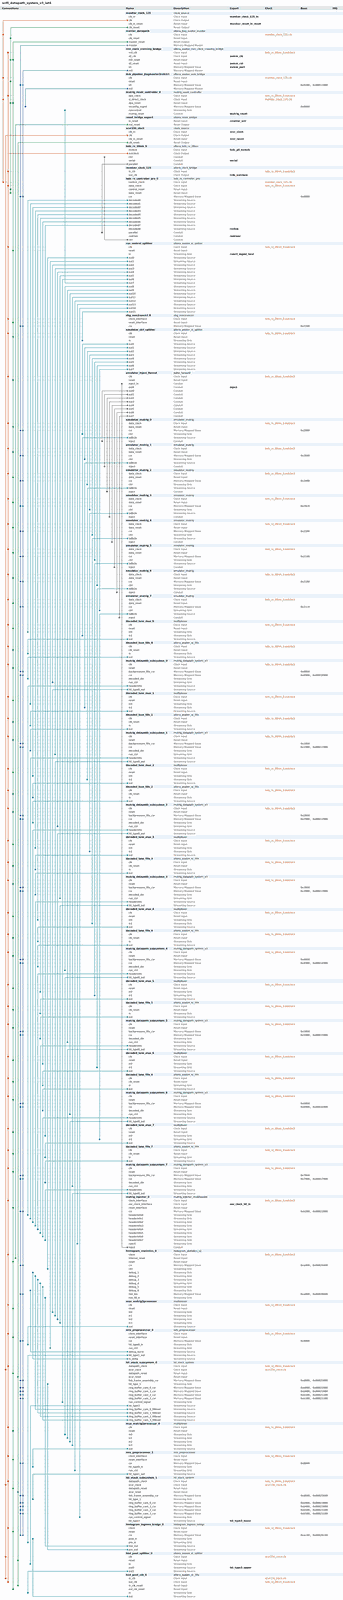
[diagram p0: system contents, whole]
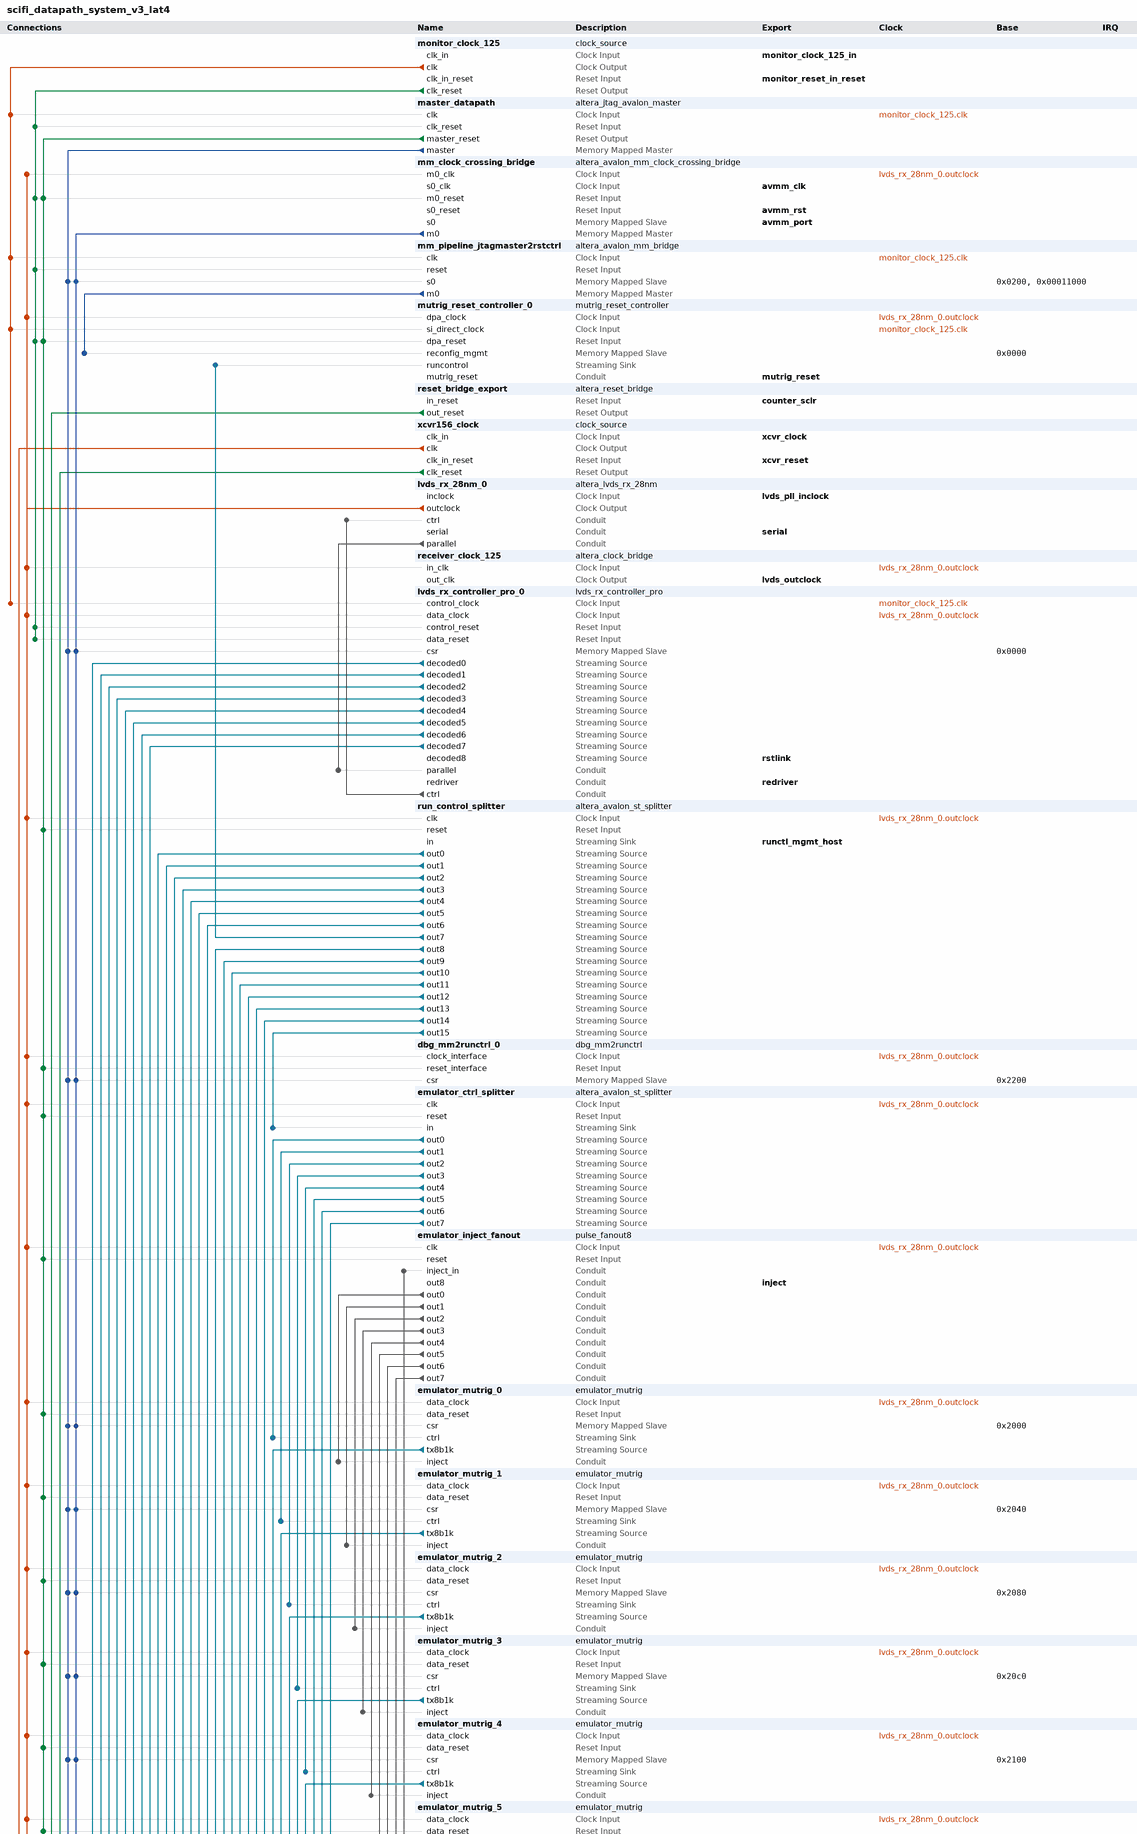
[diagram p1: system contents, upper part]
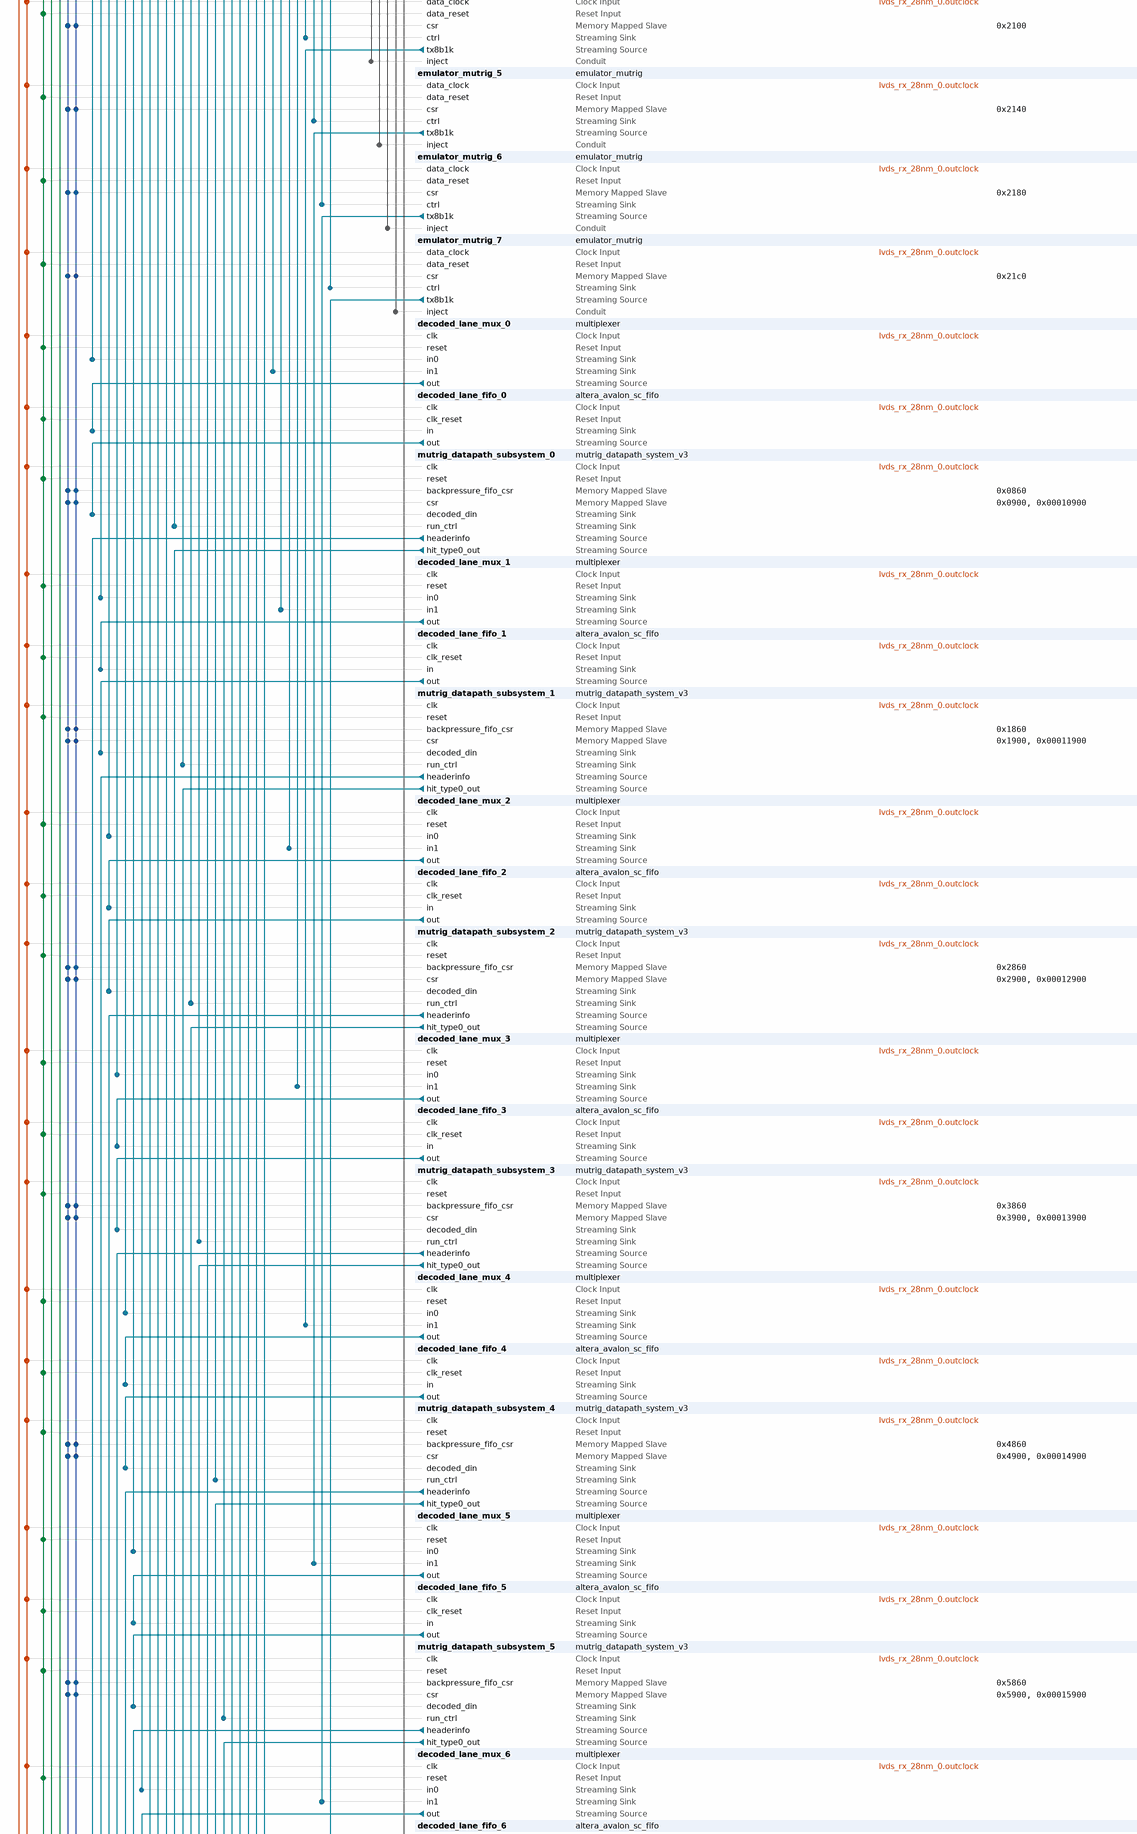
[diagram p2: system contents, middle part]
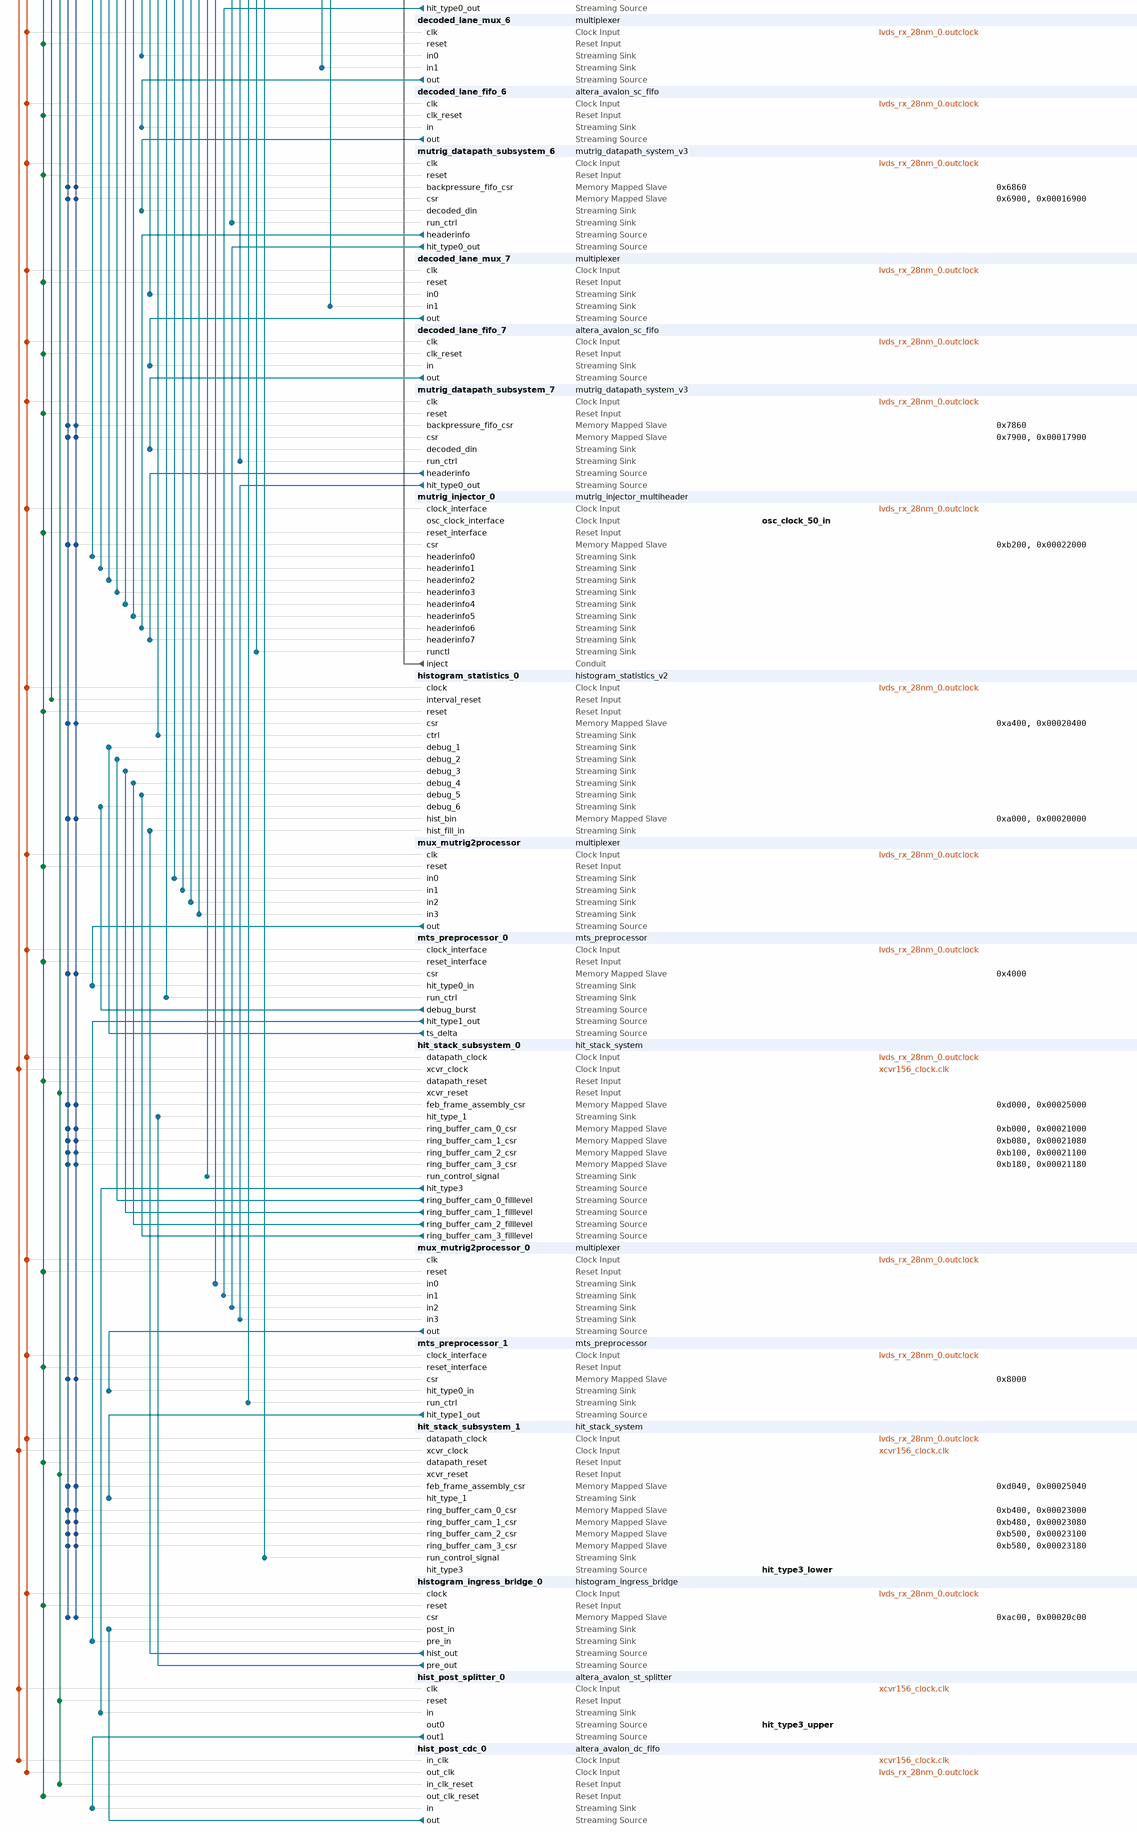
[diagram p3: system contents, lower part]
# Platform Designer (Qsys) system scifi_datapath_system_v3_lat4, Arria V 5AGXBA7D4F31C5
# Parameters at their usual value, and those the tool derives, are not listed.
package require -exact qsys 18.1
create_system scifi_datapath_system_v3_lat4
set_project_property DEVICE_FAMILY {Arria V}
set_project_property DEVICE 5AGXBA7D4F31C5

add_instance monitor_clock_125 clock_source 18.1
set_instance_parameter_value monitor_clock_125 clockFrequency 125000000
set_instance_parameter_value monitor_clock_125 resetSynchronousEdges DEASSERT

add_instance master_datapath altera_jtag_avalon_master 18.1

add_instance mm_clock_crossing_bridge altera_avalon_mm_clock_crossing_bridge 18.1
set_instance_parameter_value mm_clock_crossing_bridge ADDRESS_UNITS WORDS
set_instance_parameter_value mm_clock_crossing_bridge ADDRESS_WIDTH 14
set_instance_parameter_value mm_clock_crossing_bridge COMMAND_FIFO_DEPTH 8
set_instance_parameter_value mm_clock_crossing_bridge DATA_WIDTH 32
set_instance_parameter_value mm_clock_crossing_bridge MASTER_SYNC_DEPTH 2
set_instance_parameter_value mm_clock_crossing_bridge MAX_BURST_SIZE 256
set_instance_parameter_value mm_clock_crossing_bridge RESPONSE_FIFO_DEPTH 512
set_instance_parameter_value mm_clock_crossing_bridge SLAVE_SYNC_DEPTH 2
set_instance_parameter_value mm_clock_crossing_bridge USE_AUTO_ADDRESS_WIDTH 0

add_instance mm_pipeline_jtagmaster2rstctrl altera_avalon_mm_bridge 18.1
set_instance_parameter_value mm_pipeline_jtagmaster2rstctrl ADDRESS_UNITS WORDS
set_instance_parameter_value mm_pipeline_jtagmaster2rstctrl ADDRESS_WIDTH 6
set_instance_parameter_value mm_pipeline_jtagmaster2rstctrl DATA_WIDTH 32
set_instance_parameter_value mm_pipeline_jtagmaster2rstctrl MAX_PENDING_RESPONSES 4
set_instance_parameter_value mm_pipeline_jtagmaster2rstctrl PIPELINE_COMMAND 0
set_instance_parameter_value mm_pipeline_jtagmaster2rstctrl PIPELINE_RESPONSE 0
set_instance_parameter_value mm_pipeline_jtagmaster2rstctrl USE_AUTO_ADDRESS_WIDTH 0

add_instance mutrig_reset_controller_0 mutrig_reset_controller 1.0.8
set_instance_parameter_value mutrig_reset_controller_0 DEBUG 1
set_instance_parameter_value mutrig_reset_controller_0 RESET_LANE 2

add_instance reset_bridge_export altera_reset_bridge 18.1
set_instance_parameter_value reset_bridge_export ACTIVE_LOW_RESET 0
set_instance_parameter_value reset_bridge_export SYNCHRONOUS_EDGES none

add_instance xcvr156_clock clock_source 18.1
set_instance_parameter_value xcvr156_clock clockFrequency 156250000
set_instance_parameter_value xcvr156_clock resetSynchronousEdges BOTH

add_instance lvds_rx_28nm_0 altera_lvds_rx_28nm 24.0.1110
set_instance_parameter_value lvds_rx_28nm_0 N_LANE 9

add_instance receiver_clock_125 altera_clock_bridge 18.1
set_instance_parameter_value receiver_clock_125 DERIVED_CLOCK_RATE 125000000
set_instance_parameter_value receiver_clock_125 EXPLICIT_CLOCK_RATE 125000000

add_instance lvds_rx_controller_pro_0 lvds_rx_controller_pro 25.1.630
set_instance_parameter_value lvds_rx_controller_pro_0 AVMM_ADDR_W 4
set_instance_parameter_value lvds_rx_controller_pro_0 DECODED_USE_CHANNEL 1
set_instance_parameter_value lvds_rx_controller_pro_0 N_LANE 9
set_instance_parameter_value lvds_rx_controller_pro_0 SYNC_PATTERN_SEL 0xFA

add_instance run_control_splitter altera_avalon_st_splitter 18.1
set_instance_parameter_value run_control_splitter BITS_PER_SYMBOL 9
set_instance_parameter_value run_control_splitter CHANNEL_WIDTH 1
set_instance_parameter_value run_control_splitter DATA_WIDTH 9
set_instance_parameter_value run_control_splitter ERROR_WIDTH 1
set_instance_parameter_value run_control_splitter MAX_CHANNELS 1
set_instance_parameter_value run_control_splitter NUMBER_OF_OUTPUTS 16
set_instance_parameter_value run_control_splitter QUALIFY_VALID_OUT 0
set_instance_parameter_value run_control_splitter READY_LATENCY 0
set_instance_parameter_value run_control_splitter USE_CHANNEL 0
set_instance_parameter_value run_control_splitter USE_DATA 1
set_instance_parameter_value run_control_splitter USE_ERROR 0
set_instance_parameter_value run_control_splitter USE_PACKETS 0
set_instance_parameter_value run_control_splitter USE_READY 1
set_instance_parameter_value run_control_splitter USE_VALID 1

add_instance dbg_mm2runctrl_0 dbg_mm2runctrl 1.0.0

add_instance emulator_ctrl_splitter altera_avalon_st_splitter 18.1
set_instance_parameter_value emulator_ctrl_splitter BITS_PER_SYMBOL 9
set_instance_parameter_value emulator_ctrl_splitter CHANNEL_WIDTH 1
set_instance_parameter_value emulator_ctrl_splitter DATA_WIDTH 9
set_instance_parameter_value emulator_ctrl_splitter ERROR_WIDTH 1
set_instance_parameter_value emulator_ctrl_splitter MAX_CHANNELS 1
set_instance_parameter_value emulator_ctrl_splitter NUMBER_OF_OUTPUTS 8
set_instance_parameter_value emulator_ctrl_splitter QUALIFY_VALID_OUT 0
set_instance_parameter_value emulator_ctrl_splitter READY_LATENCY 0
set_instance_parameter_value emulator_ctrl_splitter USE_CHANNEL 0
set_instance_parameter_value emulator_ctrl_splitter USE_DATA 1
set_instance_parameter_value emulator_ctrl_splitter USE_ERROR 0
set_instance_parameter_value emulator_ctrl_splitter USE_PACKETS 0
set_instance_parameter_value emulator_ctrl_splitter USE_READY 1
set_instance_parameter_value emulator_ctrl_splitter USE_VALID 1

add_instance emulator_inject_fanout pulse_fanout8 26.2.0.0429

add_instance emulator_mutrig_0 emulator_mutrig 26.1.9.418
set_instance_parameter_value emulator_mutrig_0 ASIC_ID_DEFAULT 0
set_instance_parameter_value emulator_mutrig_0 BUILD 418
set_instance_parameter_value emulator_mutrig_0 CLUSTER_CENTER_GLOBAL_DEFAULT 16
set_instance_parameter_value emulator_mutrig_0 CLUSTER_CROSS_ASIC_DEFAULT 0
set_instance_parameter_value emulator_mutrig_0 CLUSTER_LANE_COUNT_DEFAULT 1
set_instance_parameter_value emulator_mutrig_0 CLUSTER_LANE_INDEX_DEFAULT 0
set_instance_parameter_value emulator_mutrig_0 CSR_ADDR_WIDTH 4
set_instance_parameter_value emulator_mutrig_0 DEBUG 0
set_instance_parameter_value emulator_mutrig_0 FIFO_DEPTH 64
set_instance_parameter_value emulator_mutrig_0 GIT_STAMP_OVERRIDE false
set_instance_parameter_value emulator_mutrig_0 INSTANCE_ID 0
set_instance_parameter_value emulator_mutrig_0 IP_UID 1162696020
set_instance_parameter_value emulator_mutrig_0 VERSION_DATE 20260418
set_instance_parameter_value emulator_mutrig_0 VERSION_GIT 30068584
set_instance_parameter_value emulator_mutrig_0 VERSION_MAJOR 26
set_instance_parameter_value emulator_mutrig_0 VERSION_MINOR 1
set_instance_parameter_value emulator_mutrig_0 VERSION_PATCH 9

add_instance emulator_mutrig_1 emulator_mutrig 26.1.9.418
set_instance_parameter_value emulator_mutrig_1 ASIC_ID_DEFAULT 0
set_instance_parameter_value emulator_mutrig_1 BUILD 418
set_instance_parameter_value emulator_mutrig_1 CLUSTER_CENTER_GLOBAL_DEFAULT 16
set_instance_parameter_value emulator_mutrig_1 CLUSTER_CROSS_ASIC_DEFAULT 0
set_instance_parameter_value emulator_mutrig_1 CLUSTER_LANE_COUNT_DEFAULT 1
set_instance_parameter_value emulator_mutrig_1 CLUSTER_LANE_INDEX_DEFAULT 0
set_instance_parameter_value emulator_mutrig_1 CSR_ADDR_WIDTH 4
set_instance_parameter_value emulator_mutrig_1 DEBUG 0
set_instance_parameter_value emulator_mutrig_1 FIFO_DEPTH 64
set_instance_parameter_value emulator_mutrig_1 GIT_STAMP_OVERRIDE false
set_instance_parameter_value emulator_mutrig_1 INSTANCE_ID 0
set_instance_parameter_value emulator_mutrig_1 IP_UID 1162696020
set_instance_parameter_value emulator_mutrig_1 VERSION_DATE 20260418
set_instance_parameter_value emulator_mutrig_1 VERSION_GIT 30068584
set_instance_parameter_value emulator_mutrig_1 VERSION_MAJOR 26
set_instance_parameter_value emulator_mutrig_1 VERSION_MINOR 1
set_instance_parameter_value emulator_mutrig_1 VERSION_PATCH 9

add_instance emulator_mutrig_2 emulator_mutrig 26.1.9.418
set_instance_parameter_value emulator_mutrig_2 ASIC_ID_DEFAULT 0
set_instance_parameter_value emulator_mutrig_2 BUILD 418
set_instance_parameter_value emulator_mutrig_2 CLUSTER_CENTER_GLOBAL_DEFAULT 16
set_instance_parameter_value emulator_mutrig_2 CLUSTER_CROSS_ASIC_DEFAULT 0
set_instance_parameter_value emulator_mutrig_2 CLUSTER_LANE_COUNT_DEFAULT 1
set_instance_parameter_value emulator_mutrig_2 CLUSTER_LANE_INDEX_DEFAULT 0
set_instance_parameter_value emulator_mutrig_2 CSR_ADDR_WIDTH 4
set_instance_parameter_value emulator_mutrig_2 DEBUG 0
set_instance_parameter_value emulator_mutrig_2 FIFO_DEPTH 64
set_instance_parameter_value emulator_mutrig_2 GIT_STAMP_OVERRIDE false
set_instance_parameter_value emulator_mutrig_2 INSTANCE_ID 0
set_instance_parameter_value emulator_mutrig_2 IP_UID 1162696020
set_instance_parameter_value emulator_mutrig_2 VERSION_DATE 20260418
set_instance_parameter_value emulator_mutrig_2 VERSION_GIT 30068584
set_instance_parameter_value emulator_mutrig_2 VERSION_MAJOR 26
set_instance_parameter_value emulator_mutrig_2 VERSION_MINOR 1
set_instance_parameter_value emulator_mutrig_2 VERSION_PATCH 9

add_instance emulator_mutrig_3 emulator_mutrig 26.1.9.418
set_instance_parameter_value emulator_mutrig_3 ASIC_ID_DEFAULT 0
set_instance_parameter_value emulator_mutrig_3 BUILD 418
set_instance_parameter_value emulator_mutrig_3 CLUSTER_CENTER_GLOBAL_DEFAULT 16
set_instance_parameter_value emulator_mutrig_3 CLUSTER_CROSS_ASIC_DEFAULT 0
set_instance_parameter_value emulator_mutrig_3 CLUSTER_LANE_COUNT_DEFAULT 1
set_instance_parameter_value emulator_mutrig_3 CLUSTER_LANE_INDEX_DEFAULT 0
set_instance_parameter_value emulator_mutrig_3 CSR_ADDR_WIDTH 4
set_instance_parameter_value emulator_mutrig_3 DEBUG 0
set_instance_parameter_value emulator_mutrig_3 FIFO_DEPTH 64
set_instance_parameter_value emulator_mutrig_3 GIT_STAMP_OVERRIDE false
set_instance_parameter_value emulator_mutrig_3 INSTANCE_ID 0
set_instance_parameter_value emulator_mutrig_3 IP_UID 1162696020
set_instance_parameter_value emulator_mutrig_3 VERSION_DATE 20260418
set_instance_parameter_value emulator_mutrig_3 VERSION_GIT 30068584
set_instance_parameter_value emulator_mutrig_3 VERSION_MAJOR 26
set_instance_parameter_value emulator_mutrig_3 VERSION_MINOR 1
set_instance_parameter_value emulator_mutrig_3 VERSION_PATCH 9

add_instance emulator_mutrig_4 emulator_mutrig 26.1.9.418
set_instance_parameter_value emulator_mutrig_4 ASIC_ID_DEFAULT 0
set_instance_parameter_value emulator_mutrig_4 BUILD 418
set_instance_parameter_value emulator_mutrig_4 CLUSTER_CENTER_GLOBAL_DEFAULT 16
set_instance_parameter_value emulator_mutrig_4 CLUSTER_CROSS_ASIC_DEFAULT 0
set_instance_parameter_value emulator_mutrig_4 CLUSTER_LANE_COUNT_DEFAULT 1
set_instance_parameter_value emulator_mutrig_4 CLUSTER_LANE_INDEX_DEFAULT 0
set_instance_parameter_value emulator_mutrig_4 CSR_ADDR_WIDTH 4
set_instance_parameter_value emulator_mutrig_4 DEBUG 0
set_instance_parameter_value emulator_mutrig_4 FIFO_DEPTH 64
set_instance_parameter_value emulator_mutrig_4 GIT_STAMP_OVERRIDE false
set_instance_parameter_value emulator_mutrig_4 INSTANCE_ID 0
set_instance_parameter_value emulator_mutrig_4 IP_UID 1162696020
set_instance_parameter_value emulator_mutrig_4 VERSION_DATE 20260418
set_instance_parameter_value emulator_mutrig_4 VERSION_GIT 30068584
set_instance_parameter_value emulator_mutrig_4 VERSION_MAJOR 26
set_instance_parameter_value emulator_mutrig_4 VERSION_MINOR 1
set_instance_parameter_value emulator_mutrig_4 VERSION_PATCH 9

add_instance emulator_mutrig_5 emulator_mutrig 26.1.9.418
set_instance_parameter_value emulator_mutrig_5 ASIC_ID_DEFAULT 0
set_instance_parameter_value emulator_mutrig_5 BUILD 418
set_instance_parameter_value emulator_mutrig_5 CLUSTER_CENTER_GLOBAL_DEFAULT 16
set_instance_parameter_value emulator_mutrig_5 CLUSTER_CROSS_ASIC_DEFAULT 0
set_instance_parameter_value emulator_mutrig_5 CLUSTER_LANE_COUNT_DEFAULT 1
set_instance_parameter_value emulator_mutrig_5 CLUSTER_LANE_INDEX_DEFAULT 0
set_instance_parameter_value emulator_mutrig_5 CSR_ADDR_WIDTH 4
set_instance_parameter_value emulator_mutrig_5 DEBUG 0
set_instance_parameter_value emulator_mutrig_5 FIFO_DEPTH 64
set_instance_parameter_value emulator_mutrig_5 GIT_STAMP_OVERRIDE false
set_instance_parameter_value emulator_mutrig_5 INSTANCE_ID 0
set_instance_parameter_value emulator_mutrig_5 IP_UID 1162696020
set_instance_parameter_value emulator_mutrig_5 VERSION_DATE 20260418
set_instance_parameter_value emulator_mutrig_5 VERSION_GIT 30068584
set_instance_parameter_value emulator_mutrig_5 VERSION_MAJOR 26
set_instance_parameter_value emulator_mutrig_5 VERSION_MINOR 1
set_instance_parameter_value emulator_mutrig_5 VERSION_PATCH 9

add_instance emulator_mutrig_6 emulator_mutrig 26.1.9.418
set_instance_parameter_value emulator_mutrig_6 ASIC_ID_DEFAULT 0
set_instance_parameter_value emulator_mutrig_6 BUILD 418
set_instance_parameter_value emulator_mutrig_6 CLUSTER_CENTER_GLOBAL_DEFAULT 16
set_instance_parameter_value emulator_mutrig_6 CLUSTER_CROSS_ASIC_DEFAULT 0
set_instance_parameter_value emulator_mutrig_6 CLUSTER_LANE_COUNT_DEFAULT 1
set_instance_parameter_value emulator_mutrig_6 CLUSTER_LANE_INDEX_DEFAULT 0
set_instance_parameter_value emulator_mutrig_6 CSR_ADDR_WIDTH 4
set_instance_parameter_value emulator_mutrig_6 DEBUG 0
set_instance_parameter_value emulator_mutrig_6 FIFO_DEPTH 64
set_instance_parameter_value emulator_mutrig_6 GIT_STAMP_OVERRIDE false
set_instance_parameter_value emulator_mutrig_6 INSTANCE_ID 0
set_instance_parameter_value emulator_mutrig_6 IP_UID 1162696020
set_instance_parameter_value emulator_mutrig_6 VERSION_DATE 20260418
set_instance_parameter_value emulator_mutrig_6 VERSION_GIT 30068584
set_instance_parameter_value emulator_mutrig_6 VERSION_MAJOR 26
set_instance_parameter_value emulator_mutrig_6 VERSION_MINOR 1
set_instance_parameter_value emulator_mutrig_6 VERSION_PATCH 9

add_instance emulator_mutrig_7 emulator_mutrig 26.1.9.418
set_instance_parameter_value emulator_mutrig_7 ASIC_ID_DEFAULT 0
set_instance_parameter_value emulator_mutrig_7 BUILD 418
set_instance_parameter_value emulator_mutrig_7 CLUSTER_CENTER_GLOBAL_DEFAULT 16
set_instance_parameter_value emulator_mutrig_7 CLUSTER_CROSS_ASIC_DEFAULT 0
set_instance_parameter_value emulator_mutrig_7 CLUSTER_LANE_COUNT_DEFAULT 1
set_instance_parameter_value emulator_mutrig_7 CLUSTER_LANE_INDEX_DEFAULT 0
set_instance_parameter_value emulator_mutrig_7 CSR_ADDR_WIDTH 4
set_instance_parameter_value emulator_mutrig_7 DEBUG 0
set_instance_parameter_value emulator_mutrig_7 FIFO_DEPTH 64
set_instance_parameter_value emulator_mutrig_7 GIT_STAMP_OVERRIDE false
set_instance_parameter_value emulator_mutrig_7 INSTANCE_ID 0
set_instance_parameter_value emulator_mutrig_7 IP_UID 1162696020
set_instance_parameter_value emulator_mutrig_7 VERSION_DATE 20260418
set_instance_parameter_value emulator_mutrig_7 VERSION_GIT 30068584
set_instance_parameter_value emulator_mutrig_7 VERSION_MAJOR 26
set_instance_parameter_value emulator_mutrig_7 VERSION_MINOR 1
set_instance_parameter_value emulator_mutrig_7 VERSION_PATCH 9

add_instance decoded_lane_mux_0 multiplexer 18.1
set_instance_parameter_value decoded_lane_mux_0 bitsPerSymbol 9
set_instance_parameter_value decoded_lane_mux_0 errorWidth 3
set_instance_parameter_value decoded_lane_mux_0 numInputInterfaces 2
set_instance_parameter_value decoded_lane_mux_0 outChannelWidth 5
set_instance_parameter_value decoded_lane_mux_0 packetScheduling false
set_instance_parameter_value decoded_lane_mux_0 schedulingSize 1
set_instance_parameter_value decoded_lane_mux_0 symbolsPerBeat 1
set_instance_parameter_value decoded_lane_mux_0 useHighBitsOfChannel true
set_instance_parameter_value decoded_lane_mux_0 usePackets false

add_instance decoded_lane_fifo_0 altera_avalon_sc_fifo 18.1
set_instance_parameter_value decoded_lane_fifo_0 BITS_PER_SYMBOL 9
set_instance_parameter_value decoded_lane_fifo_0 CHANNEL_WIDTH 5
set_instance_parameter_value decoded_lane_fifo_0 ERROR_WIDTH 3
set_instance_parameter_value decoded_lane_fifo_0 FIFO_DEPTH 8
set_instance_parameter_value decoded_lane_fifo_0 USE_FILL_LEVEL 0
set_instance_parameter_value decoded_lane_fifo_0 USE_MEMORY_BLOCKS 0
set_instance_parameter_value decoded_lane_fifo_0 USE_STORE_FORWARD 0

add_instance mutrig_datapath_subsystem_0 mutrig_datapath_system_v3 1.0

add_instance decoded_lane_mux_1 multiplexer 18.1
set_instance_parameter_value decoded_lane_mux_1 bitsPerSymbol 9
set_instance_parameter_value decoded_lane_mux_1 errorWidth 3
set_instance_parameter_value decoded_lane_mux_1 numInputInterfaces 2
set_instance_parameter_value decoded_lane_mux_1 outChannelWidth 5
set_instance_parameter_value decoded_lane_mux_1 packetScheduling false
set_instance_parameter_value decoded_lane_mux_1 schedulingSize 1
set_instance_parameter_value decoded_lane_mux_1 symbolsPerBeat 1
set_instance_parameter_value decoded_lane_mux_1 useHighBitsOfChannel true
set_instance_parameter_value decoded_lane_mux_1 usePackets false

add_instance decoded_lane_fifo_1 altera_avalon_sc_fifo 18.1
set_instance_parameter_value decoded_lane_fifo_1 BITS_PER_SYMBOL 9
set_instance_parameter_value decoded_lane_fifo_1 CHANNEL_WIDTH 5
set_instance_parameter_value decoded_lane_fifo_1 ERROR_WIDTH 3
set_instance_parameter_value decoded_lane_fifo_1 FIFO_DEPTH 8
set_instance_parameter_value decoded_lane_fifo_1 USE_FILL_LEVEL 0
set_instance_parameter_value decoded_lane_fifo_1 USE_MEMORY_BLOCKS 0
set_instance_parameter_value decoded_lane_fifo_1 USE_STORE_FORWARD 0

add_instance mutrig_datapath_subsystem_1 mutrig_datapath_system_v3 1.0

add_instance decoded_lane_mux_2 multiplexer 18.1
set_instance_parameter_value decoded_lane_mux_2 bitsPerSymbol 9
set_instance_parameter_value decoded_lane_mux_2 errorWidth 3
set_instance_parameter_value decoded_lane_mux_2 numInputInterfaces 2
set_instance_parameter_value decoded_lane_mux_2 outChannelWidth 5
set_instance_parameter_value decoded_lane_mux_2 packetScheduling false
set_instance_parameter_value decoded_lane_mux_2 schedulingSize 1
set_instance_parameter_value decoded_lane_mux_2 symbolsPerBeat 1
set_instance_parameter_value decoded_lane_mux_2 useHighBitsOfChannel true
set_instance_parameter_value decoded_lane_mux_2 usePackets false

add_instance decoded_lane_fifo_2 altera_avalon_sc_fifo 18.1
set_instance_parameter_value decoded_lane_fifo_2 BITS_PER_SYMBOL 9
set_instance_parameter_value decoded_lane_fifo_2 CHANNEL_WIDTH 5
set_instance_parameter_value decoded_lane_fifo_2 ERROR_WIDTH 3
set_instance_parameter_value decoded_lane_fifo_2 FIFO_DEPTH 8
set_instance_parameter_value decoded_lane_fifo_2 USE_FILL_LEVEL 0
set_instance_parameter_value decoded_lane_fifo_2 USE_MEMORY_BLOCKS 0
set_instance_parameter_value decoded_lane_fifo_2 USE_STORE_FORWARD 0

add_instance mutrig_datapath_subsystem_2 mutrig_datapath_system_v3 1.0

add_instance decoded_lane_mux_3 multiplexer 18.1
set_instance_parameter_value decoded_lane_mux_3 bitsPerSymbol 9
set_instance_parameter_value decoded_lane_mux_3 errorWidth 3
set_instance_parameter_value decoded_lane_mux_3 numInputInterfaces 2
set_instance_parameter_value decoded_lane_mux_3 outChannelWidth 5
set_instance_parameter_value decoded_lane_mux_3 packetScheduling false
set_instance_parameter_value decoded_lane_mux_3 schedulingSize 1
set_instance_parameter_value decoded_lane_mux_3 symbolsPerBeat 1
set_instance_parameter_value decoded_lane_mux_3 useHighBitsOfChannel true
set_instance_parameter_value decoded_lane_mux_3 usePackets false

add_instance decoded_lane_fifo_3 altera_avalon_sc_fifo 18.1
set_instance_parameter_value decoded_lane_fifo_3 BITS_PER_SYMBOL 9
set_instance_parameter_value decoded_lane_fifo_3 CHANNEL_WIDTH 5
set_instance_parameter_value decoded_lane_fifo_3 ERROR_WIDTH 3
set_instance_parameter_value decoded_lane_fifo_3 FIFO_DEPTH 8
set_instance_parameter_value decoded_lane_fifo_3 USE_FILL_LEVEL 0
set_instance_parameter_value decoded_lane_fifo_3 USE_MEMORY_BLOCKS 0
set_instance_parameter_value decoded_lane_fifo_3 USE_STORE_FORWARD 0

add_instance mutrig_datapath_subsystem_3 mutrig_datapath_system_v3 1.0

add_instance decoded_lane_mux_4 multiplexer 18.1
set_instance_parameter_value decoded_lane_mux_4 bitsPerSymbol 9
set_instance_parameter_value decoded_lane_mux_4 errorWidth 3
set_instance_parameter_value decoded_lane_mux_4 numInputInterfaces 2
set_instance_parameter_value decoded_lane_mux_4 outChannelWidth 5
set_instance_parameter_value decoded_lane_mux_4 packetScheduling false
set_instance_parameter_value decoded_lane_mux_4 schedulingSize 1
set_instance_parameter_value decoded_lane_mux_4 symbolsPerBeat 1
set_instance_parameter_value decoded_lane_mux_4 useHighBitsOfChannel true
set_instance_parameter_value decoded_lane_mux_4 usePackets false

add_instance decoded_lane_fifo_4 altera_avalon_sc_fifo 18.1
set_instance_parameter_value decoded_lane_fifo_4 BITS_PER_SYMBOL 9
set_instance_parameter_value decoded_lane_fifo_4 CHANNEL_WIDTH 5
set_instance_parameter_value decoded_lane_fifo_4 ERROR_WIDTH 3
set_instance_parameter_value decoded_lane_fifo_4 FIFO_DEPTH 8
set_instance_parameter_value decoded_lane_fifo_4 USE_FILL_LEVEL 0
set_instance_parameter_value decoded_lane_fifo_4 USE_MEMORY_BLOCKS 0
set_instance_parameter_value decoded_lane_fifo_4 USE_STORE_FORWARD 0

add_instance mutrig_datapath_subsystem_4 mutrig_datapath_system_v3 1.0

add_instance decoded_lane_mux_5 multiplexer 18.1
set_instance_parameter_value decoded_lane_mux_5 bitsPerSymbol 9
set_instance_parameter_value decoded_lane_mux_5 errorWidth 3
set_instance_parameter_value decoded_lane_mux_5 numInputInterfaces 2
set_instance_parameter_value decoded_lane_mux_5 outChannelWidth 5
set_instance_parameter_value decoded_lane_mux_5 packetScheduling false
set_instance_parameter_value decoded_lane_mux_5 schedulingSize 1
set_instance_parameter_value decoded_lane_mux_5 symbolsPerBeat 1
set_instance_parameter_value decoded_lane_mux_5 useHighBitsOfChannel true
set_instance_parameter_value decoded_lane_mux_5 usePackets false

add_instance decoded_lane_fifo_5 altera_avalon_sc_fifo 18.1
set_instance_parameter_value decoded_lane_fifo_5 BITS_PER_SYMBOL 9
set_instance_parameter_value decoded_lane_fifo_5 CHANNEL_WIDTH 5
set_instance_parameter_value decoded_lane_fifo_5 ERROR_WIDTH 3
set_instance_parameter_value decoded_lane_fifo_5 FIFO_DEPTH 8
set_instance_parameter_value decoded_lane_fifo_5 USE_FILL_LEVEL 0
set_instance_parameter_value decoded_lane_fifo_5 USE_MEMORY_BLOCKS 0
set_instance_parameter_value decoded_lane_fifo_5 USE_STORE_FORWARD 0

add_instance mutrig_datapath_subsystem_5 mutrig_datapath_system_v3 1.0

add_instance decoded_lane_mux_6 multiplexer 18.1
set_instance_parameter_value decoded_lane_mux_6 bitsPerSymbol 9
set_instance_parameter_value decoded_lane_mux_6 errorWidth 3
set_instance_parameter_value decoded_lane_mux_6 numInputInterfaces 2
set_instance_parameter_value decoded_lane_mux_6 outChannelWidth 5
set_instance_parameter_value decoded_lane_mux_6 packetScheduling false
set_instance_parameter_value decoded_lane_mux_6 schedulingSize 1
set_instance_parameter_value decoded_lane_mux_6 symbolsPerBeat 1
set_instance_parameter_value decoded_lane_mux_6 useHighBitsOfChannel true
set_instance_parameter_value decoded_lane_mux_6 usePackets false

add_instance decoded_lane_fifo_6 altera_avalon_sc_fifo 18.1
set_instance_parameter_value decoded_lane_fifo_6 BITS_PER_SYMBOL 9
set_instance_parameter_value decoded_lane_fifo_6 CHANNEL_WIDTH 5
set_instance_parameter_value decoded_lane_fifo_6 ERROR_WIDTH 3
set_instance_parameter_value decoded_lane_fifo_6 FIFO_DEPTH 8
set_instance_parameter_value decoded_lane_fifo_6 USE_FILL_LEVEL 0
set_instance_parameter_value decoded_lane_fifo_6 USE_MEMORY_BLOCKS 0
set_instance_parameter_value decoded_lane_fifo_6 USE_STORE_FORWARD 0

add_instance mutrig_datapath_subsystem_6 mutrig_datapath_system_v3 1.0

add_instance decoded_lane_mux_7 multiplexer 18.1
set_instance_parameter_value decoded_lane_mux_7 bitsPerSymbol 9
set_instance_parameter_value decoded_lane_mux_7 errorWidth 3
set_instance_parameter_value decoded_lane_mux_7 numInputInterfaces 2
set_instance_parameter_value decoded_lane_mux_7 outChannelWidth 5
set_instance_parameter_value decoded_lane_mux_7 packetScheduling false
set_instance_parameter_value decoded_lane_mux_7 schedulingSize 1
set_instance_parameter_value decoded_lane_mux_7 symbolsPerBeat 1
set_instance_parameter_value decoded_lane_mux_7 useHighBitsOfChannel true
set_instance_parameter_value decoded_lane_mux_7 usePackets false

add_instance decoded_lane_fifo_7 altera_avalon_sc_fifo 18.1
set_instance_parameter_value decoded_lane_fifo_7 BITS_PER_SYMBOL 9
set_instance_parameter_value decoded_lane_fifo_7 CHANNEL_WIDTH 5
set_instance_parameter_value decoded_lane_fifo_7 ERROR_WIDTH 3
set_instance_parameter_value decoded_lane_fifo_7 FIFO_DEPTH 8
set_instance_parameter_value decoded_lane_fifo_7 USE_FILL_LEVEL 0
set_instance_parameter_value decoded_lane_fifo_7 USE_MEMORY_BLOCKS 0
set_instance_parameter_value decoded_lane_fifo_7 USE_STORE_FORWARD 0

add_instance mutrig_datapath_subsystem_7 mutrig_datapath_system_v3 1.0

add_instance mutrig_injector_0 mutrig_injector_multiheader 26.0.2.0429
set_instance_parameter_value mutrig_injector_0 HEADERINFO_CHANNEL_W 4

add_instance histogram_statistics_0 histogram_statistics_v2 26.1.1.416
set_instance_parameter_value histogram_statistics_0 AVST_CHANNEL_WIDTH 4
set_instance_parameter_value histogram_statistics_0 AVST_DATA_WIDTH 39
set_instance_parameter_value histogram_statistics_0 AVS_ADDR_WIDTH 8
set_instance_parameter_value histogram_statistics_0 BUILD 0
set_instance_parameter_value histogram_statistics_0 CHANNELS_PER_PORT 32
set_instance_parameter_value histogram_statistics_0 COAL_QUEUE_DEPTH 256
set_instance_parameter_value histogram_statistics_0 DEBUG 0
set_instance_parameter_value histogram_statistics_0 DEF_BIN_WIDTH 1
set_instance_parameter_value histogram_statistics_0 DEF_INTERVAL_CLOCKS 125000000
set_instance_parameter_value histogram_statistics_0 DEF_LEFT_BOUND 0
set_instance_parameter_value histogram_statistics_0 ENABLE_PACKET false
set_instance_parameter_value histogram_statistics_0 ENABLE_PINGPONG true
set_instance_parameter_value histogram_statistics_0 FILTER_KEY_BIT_HI 38
set_instance_parameter_value histogram_statistics_0 FILTER_KEY_BIT_LO 35
set_instance_parameter_value histogram_statistics_0 GIT_STAMP_OVERRIDE false
set_instance_parameter_value histogram_statistics_0 INSTANCE_ID 0
set_instance_parameter_value histogram_statistics_0 IP_UID 1212765012
set_instance_parameter_value histogram_statistics_0 MAX_COUNT_BITS 32
set_instance_parameter_value histogram_statistics_0 N_BINS 256
set_instance_parameter_value histogram_statistics_0 N_DEBUG_INTERFACE 6
set_instance_parameter_value histogram_statistics_0 N_PORTS 1
set_instance_parameter_value histogram_statistics_0 SAR_KEY_WIDTH 8
set_instance_parameter_value histogram_statistics_0 SAR_TICK_WIDTH 16
set_instance_parameter_value histogram_statistics_0 SNOOP_EN false
set_instance_parameter_value histogram_statistics_0 UPDATE_KEY_BIT_HI 29
set_instance_parameter_value histogram_statistics_0 UPDATE_KEY_BIT_LO 17
set_instance_parameter_value histogram_statistics_0 UPDATE_KEY_REPRESENTATION SIGNED
set_instance_parameter_value histogram_statistics_0 VERSION_DATE 20260416
set_instance_parameter_value histogram_statistics_0 VERSION_GIT 72231161
set_instance_parameter_value histogram_statistics_0 VERSION_MAJOR 26
set_instance_parameter_value histogram_statistics_0 VERSION_MINOR 0
set_instance_parameter_value histogram_statistics_0 VERSION_PATCH 0

add_instance mux_mutrig2processor multiplexer 18.1
set_instance_parameter_value mux_mutrig2processor bitsPerSymbol 45
set_instance_parameter_value mux_mutrig2processor errorWidth 3
set_instance_parameter_value mux_mutrig2processor numInputInterfaces 4
set_instance_parameter_value mux_mutrig2processor outChannelWidth 6
set_instance_parameter_value mux_mutrig2processor packetScheduling false
set_instance_parameter_value mux_mutrig2processor schedulingSize 1
set_instance_parameter_value mux_mutrig2processor symbolsPerBeat 1
set_instance_parameter_value mux_mutrig2processor useHighBitsOfChannel true
set_instance_parameter_value mux_mutrig2processor usePackets true

add_instance mts_preprocessor_0 mts_preprocessor 26.0.2.416
set_instance_parameter_value mts_preprocessor_0 BANK UP
set_instance_parameter_value mts_preprocessor_0 BUILD 416
set_instance_parameter_value mts_preprocessor_0 CRCERR_BIT_LOC 1
set_instance_parameter_value mts_preprocessor_0 DEBUG 1
set_instance_parameter_value mts_preprocessor_0 ENABLED_CHANNEL_HI 3
set_instance_parameter_value mts_preprocessor_0 ENABLED_CHANNEL_LO 0
set_instance_parameter_value mts_preprocessor_0 FRAME_CORRPT_BIT_LOC 2
set_instance_parameter_value mts_preprocessor_0 GIT_STAMP_OVERRIDE false
set_instance_parameter_value mts_preprocessor_0 HITERR_BIT_LOC 0
set_instance_parameter_value mts_preprocessor_0 INSTANCE_ID 0
set_instance_parameter_value mts_preprocessor_0 IP_UID 1297376080
set_instance_parameter_value mts_preprocessor_0 LPM_DIV_PIPELINE 4
set_instance_parameter_value mts_preprocessor_0 MUTRIG_BUFFER_EXPECTED_LATENCY_8N 2000
set_instance_parameter_value mts_preprocessor_0 PADDING_EOP_WAIT_CYCLE 512
set_instance_parameter_value mts_preprocessor_0 VERSION_DATE 20260416
set_instance_parameter_value mts_preprocessor_0 VERSION_GIT 30068584
set_instance_parameter_value mts_preprocessor_0 VERSION_MAJOR 26
set_instance_parameter_value mts_preprocessor_0 VERSION_MINOR 0
set_instance_parameter_value mts_preprocessor_0 VERSION_PATCH 2

add_instance hit_stack_subsystem_0 hit_stack_system 1.0

add_instance mux_mutrig2processor_0 multiplexer 18.1
set_instance_parameter_value mux_mutrig2processor_0 bitsPerSymbol 45
set_instance_parameter_value mux_mutrig2processor_0 errorWidth 3
set_instance_parameter_value mux_mutrig2processor_0 numInputInterfaces 4
set_instance_parameter_value mux_mutrig2processor_0 outChannelWidth 6
set_instance_parameter_value mux_mutrig2processor_0 packetScheduling false
set_instance_parameter_value mux_mutrig2processor_0 schedulingSize 1
set_instance_parameter_value mux_mutrig2processor_0 symbolsPerBeat 1
set_instance_parameter_value mux_mutrig2processor_0 useHighBitsOfChannel true
set_instance_parameter_value mux_mutrig2processor_0 usePackets true

add_instance mts_preprocessor_1 mts_preprocessor 26.0.2.416
set_instance_parameter_value mts_preprocessor_1 BANK DW
set_instance_parameter_value mts_preprocessor_1 BUILD 416
set_instance_parameter_value mts_preprocessor_1 CRCERR_BIT_LOC 1
set_instance_parameter_value mts_preprocessor_1 DEBUG 1
set_instance_parameter_value mts_preprocessor_1 ENABLED_CHANNEL_HI 3
set_instance_parameter_value mts_preprocessor_1 ENABLED_CHANNEL_LO 0
set_instance_parameter_value mts_preprocessor_1 FRAME_CORRPT_BIT_LOC 2
set_instance_parameter_value mts_preprocessor_1 GIT_STAMP_OVERRIDE false
set_instance_parameter_value mts_preprocessor_1 HITERR_BIT_LOC 0
set_instance_parameter_value mts_preprocessor_1 INSTANCE_ID 0
set_instance_parameter_value mts_preprocessor_1 IP_UID 1297376080
set_instance_parameter_value mts_preprocessor_1 LPM_DIV_PIPELINE 4
set_instance_parameter_value mts_preprocessor_1 MUTRIG_BUFFER_EXPECTED_LATENCY_8N 2000
set_instance_parameter_value mts_preprocessor_1 PADDING_EOP_WAIT_CYCLE 512
set_instance_parameter_value mts_preprocessor_1 VERSION_DATE 20260416
set_instance_parameter_value mts_preprocessor_1 VERSION_GIT 30068584
set_instance_parameter_value mts_preprocessor_1 VERSION_MAJOR 26
set_instance_parameter_value mts_preprocessor_1 VERSION_MINOR 0
set_instance_parameter_value mts_preprocessor_1 VERSION_PATCH 2

add_instance hit_stack_subsystem_1 hit_stack_system 1.0

add_instance histogram_ingress_bridge_0 histogram_ingress_bridge 26.0.1.421
set_instance_parameter_value histogram_ingress_bridge_0 BUILD 421
set_instance_parameter_value histogram_ingress_bridge_0 DEFAULT_SELECT_POST 0
set_instance_parameter_value histogram_ingress_bridge_0 ENABLE_POST_FORWARD 0
set_instance_parameter_value histogram_ingress_bridge_0 INSTANCE_ID 0
set_instance_parameter_value histogram_ingress_bridge_0 IP_UID 1212764994
set_instance_parameter_value histogram_ingress_bridge_0 VERSION_DATE 20260421
set_instance_parameter_value histogram_ingress_bridge_0 VERSION_GIT 481097348
set_instance_parameter_value histogram_ingress_bridge_0 VERSION_MAJOR 26
set_instance_parameter_value histogram_ingress_bridge_0 VERSION_MINOR 0
set_instance_parameter_value histogram_ingress_bridge_0 VERSION_PATCH 0

add_instance hist_post_splitter_0 altera_avalon_st_splitter 18.1
set_instance_parameter_value hist_post_splitter_0 BITS_PER_SYMBOL 36
set_instance_parameter_value hist_post_splitter_0 CHANNEL_WIDTH 1
set_instance_parameter_value hist_post_splitter_0 DATA_WIDTH 36
set_instance_parameter_value hist_post_splitter_0 ERROR_WIDTH 1
set_instance_parameter_value hist_post_splitter_0 MAX_CHANNELS 1
set_instance_parameter_value hist_post_splitter_0 NUMBER_OF_OUTPUTS 2
set_instance_parameter_value hist_post_splitter_0 QUALIFY_VALID_OUT 0
set_instance_parameter_value hist_post_splitter_0 READY_LATENCY 0
set_instance_parameter_value hist_post_splitter_0 USE_CHANNEL 0
set_instance_parameter_value hist_post_splitter_0 USE_DATA 1
set_instance_parameter_value hist_post_splitter_0 USE_ERROR 0
set_instance_parameter_value hist_post_splitter_0 USE_PACKETS 1
set_instance_parameter_value hist_post_splitter_0 USE_READY 1
set_instance_parameter_value hist_post_splitter_0 USE_VALID 1

add_instance hist_post_cdc_0 altera_avalon_dc_fifo 18.1
set_instance_parameter_value hist_post_cdc_0 BITS_PER_SYMBOL 36
set_instance_parameter_value hist_post_cdc_0 FIFO_DEPTH 256
set_instance_parameter_value hist_post_cdc_0 USE_PACKETS 1

# connections
add_connection lvds_rx_28nm_0.outclock dbg_mm2runctrl_0.clock_interface clock
add_connection lvds_rx_28nm_0.outclock decoded_lane_fifo_0.clk clock
add_connection lvds_rx_28nm_0.outclock decoded_lane_fifo_1.clk clock
add_connection lvds_rx_28nm_0.outclock decoded_lane_fifo_2.clk clock
add_connection lvds_rx_28nm_0.outclock decoded_lane_fifo_3.clk clock
add_connection lvds_rx_28nm_0.outclock decoded_lane_fifo_4.clk clock
add_connection lvds_rx_28nm_0.outclock decoded_lane_fifo_5.clk clock
add_connection lvds_rx_28nm_0.outclock decoded_lane_fifo_6.clk clock
add_connection lvds_rx_28nm_0.outclock decoded_lane_fifo_7.clk clock
add_connection lvds_rx_28nm_0.outclock decoded_lane_mux_0.clk clock
add_connection lvds_rx_28nm_0.outclock decoded_lane_mux_1.clk clock
add_connection lvds_rx_28nm_0.outclock decoded_lane_mux_2.clk clock
add_connection lvds_rx_28nm_0.outclock decoded_lane_mux_3.clk clock
add_connection lvds_rx_28nm_0.outclock decoded_lane_mux_4.clk clock
add_connection lvds_rx_28nm_0.outclock decoded_lane_mux_5.clk clock
add_connection lvds_rx_28nm_0.outclock decoded_lane_mux_6.clk clock
add_connection lvds_rx_28nm_0.outclock decoded_lane_mux_7.clk clock
add_connection lvds_rx_28nm_0.outclock emulator_ctrl_splitter.clk clock
add_connection lvds_rx_28nm_0.outclock emulator_inject_fanout.clk clock
add_connection lvds_rx_28nm_0.outclock emulator_mutrig_0.data_clock clock
add_connection lvds_rx_28nm_0.outclock emulator_mutrig_1.data_clock clock
add_connection lvds_rx_28nm_0.outclock emulator_mutrig_2.data_clock clock
add_connection lvds_rx_28nm_0.outclock emulator_mutrig_3.data_clock clock
add_connection lvds_rx_28nm_0.outclock emulator_mutrig_4.data_clock clock
add_connection lvds_rx_28nm_0.outclock emulator_mutrig_5.data_clock clock
add_connection lvds_rx_28nm_0.outclock emulator_mutrig_6.data_clock clock
add_connection lvds_rx_28nm_0.outclock emulator_mutrig_7.data_clock clock
add_connection lvds_rx_28nm_0.outclock hist_post_cdc_0.out_clk clock
add_connection lvds_rx_28nm_0.outclock histogram_ingress_bridge_0.clock clock
add_connection lvds_rx_28nm_0.outclock histogram_statistics_0.clock clock
add_connection lvds_rx_28nm_0.outclock hit_stack_subsystem_0.datapath_clock clock
add_connection lvds_rx_28nm_0.outclock hit_stack_subsystem_1.datapath_clock clock
add_connection lvds_rx_28nm_0.outclock lvds_rx_controller_pro_0.data_clock clock
add_connection lvds_rx_28nm_0.outclock mm_clock_crossing_bridge.m0_clk clock
add_connection lvds_rx_28nm_0.outclock mts_preprocessor_0.clock_interface clock
add_connection lvds_rx_28nm_0.outclock mts_preprocessor_1.clock_interface clock
add_connection lvds_rx_28nm_0.outclock mutrig_datapath_subsystem_0.clk clock
add_connection lvds_rx_28nm_0.outclock mutrig_datapath_subsystem_1.clk clock
add_connection lvds_rx_28nm_0.outclock mutrig_datapath_subsystem_2.clk clock
add_connection lvds_rx_28nm_0.outclock mutrig_datapath_subsystem_3.clk clock
add_connection lvds_rx_28nm_0.outclock mutrig_datapath_subsystem_4.clk clock
add_connection lvds_rx_28nm_0.outclock mutrig_datapath_subsystem_5.clk clock
add_connection lvds_rx_28nm_0.outclock mutrig_datapath_subsystem_6.clk clock
add_connection lvds_rx_28nm_0.outclock mutrig_datapath_subsystem_7.clk clock
add_connection lvds_rx_28nm_0.outclock mutrig_injector_0.clock_interface clock
add_connection lvds_rx_28nm_0.outclock mutrig_reset_controller_0.dpa_clock clock
add_connection lvds_rx_28nm_0.outclock mux_mutrig2processor.clk clock
add_connection lvds_rx_28nm_0.outclock mux_mutrig2processor_0.clk clock
add_connection lvds_rx_28nm_0.outclock receiver_clock_125.in_clk clock
add_connection lvds_rx_28nm_0.outclock run_control_splitter.clk clock
add_connection monitor_clock_125.clk lvds_rx_controller_pro_0.control_clock clock
add_connection monitor_clock_125.clk master_datapath.clk clock
add_connection monitor_clock_125.clk mm_pipeline_jtagmaster2rstctrl.clk clock
add_connection monitor_clock_125.clk mutrig_reset_controller_0.si_direct_clock clock
add_connection xcvr156_clock.clk hist_post_cdc_0.in_clk clock
add_connection xcvr156_clock.clk hist_post_splitter_0.clk clock
add_connection xcvr156_clock.clk hit_stack_subsystem_0.xcvr_clock clock
add_connection xcvr156_clock.clk hit_stack_subsystem_1.xcvr_clock clock
add_connection master_datapath.master_reset dbg_mm2runctrl_0.reset_interface reset
add_connection master_datapath.master_reset decoded_lane_fifo_0.clk_reset reset
add_connection master_datapath.master_reset decoded_lane_fifo_1.clk_reset reset
add_connection master_datapath.master_reset decoded_lane_fifo_2.clk_reset reset
add_connection master_datapath.master_reset decoded_lane_fifo_3.clk_reset reset
add_connection master_datapath.master_reset decoded_lane_fifo_4.clk_reset reset
add_connection master_datapath.master_reset decoded_lane_fifo_5.clk_reset reset
add_connection master_datapath.master_reset decoded_lane_fifo_6.clk_reset reset
add_connection master_datapath.master_reset decoded_lane_fifo_7.clk_reset reset
add_connection master_datapath.master_reset decoded_lane_mux_0.reset reset
add_connection master_datapath.master_reset decoded_lane_mux_1.reset reset
add_connection master_datapath.master_reset decoded_lane_mux_2.reset reset
add_connection master_datapath.master_reset decoded_lane_mux_3.reset reset
add_connection master_datapath.master_reset decoded_lane_mux_4.reset reset
add_connection master_datapath.master_reset decoded_lane_mux_5.reset reset
add_connection master_datapath.master_reset decoded_lane_mux_6.reset reset
add_connection master_datapath.master_reset decoded_lane_mux_7.reset reset
add_connection master_datapath.master_reset emulator_ctrl_splitter.reset reset
add_connection master_datapath.master_reset emulator_inject_fanout.reset reset
add_connection master_datapath.master_reset emulator_mutrig_0.data_reset reset
add_connection master_datapath.master_reset emulator_mutrig_1.data_reset reset
add_connection master_datapath.master_reset emulator_mutrig_2.data_reset reset
add_connection master_datapath.master_reset emulator_mutrig_3.data_reset reset
add_connection master_datapath.master_reset emulator_mutrig_4.data_reset reset
add_connection master_datapath.master_reset emulator_mutrig_5.data_reset reset
add_connection master_datapath.master_reset emulator_mutrig_6.data_reset reset
add_connection master_datapath.master_reset emulator_mutrig_7.data_reset reset
add_connection master_datapath.master_reset hist_post_cdc_0.out_clk_reset reset
add_connection master_datapath.master_reset histogram_ingress_bridge_0.reset reset
add_connection master_datapath.master_reset histogram_statistics_0.reset reset
add_connection master_datapath.master_reset hit_stack_subsystem_0.datapath_reset reset
add_connection master_datapath.master_reset hit_stack_subsystem_1.datapath_reset reset
add_connection master_datapath.master_reset mm_clock_crossing_bridge.m0_reset reset
add_connection master_datapath.master_reset mts_preprocessor_0.reset_interface reset
add_connection master_datapath.master_reset mts_preprocessor_1.reset_interface reset
add_connection master_datapath.master_reset mutrig_datapath_subsystem_0.reset reset
add_connection master_datapath.master_reset mutrig_datapath_subsystem_1.reset reset
add_connection master_datapath.master_reset mutrig_datapath_subsystem_2.reset reset
add_connection master_datapath.master_reset mutrig_datapath_subsystem_3.reset reset
add_connection master_datapath.master_reset mutrig_datapath_subsystem_4.reset reset
add_connection master_datapath.master_reset mutrig_datapath_subsystem_5.reset reset
add_connection master_datapath.master_reset mutrig_datapath_subsystem_6.reset reset
add_connection master_datapath.master_reset mutrig_datapath_subsystem_7.reset reset
add_connection master_datapath.master_reset mutrig_injector_0.reset_interface reset
add_connection master_datapath.master_reset mutrig_reset_controller_0.dpa_reset reset
add_connection master_datapath.master_reset mux_mutrig2processor.reset reset
add_connection master_datapath.master_reset mux_mutrig2processor_0.reset reset
add_connection master_datapath.master_reset run_control_splitter.reset reset
add_connection monitor_clock_125.clk_reset lvds_rx_controller_pro_0.control_reset reset
add_connection monitor_clock_125.clk_reset lvds_rx_controller_pro_0.data_reset reset
add_connection monitor_clock_125.clk_reset master_datapath.clk_reset reset
add_connection monitor_clock_125.clk_reset mm_clock_crossing_bridge.m0_reset reset
add_connection monitor_clock_125.clk_reset mm_pipeline_jtagmaster2rstctrl.reset reset
add_connection monitor_clock_125.clk_reset mutrig_reset_controller_0.dpa_reset reset
add_connection reset_bridge_export.out_reset histogram_statistics_0.interval_reset reset
add_connection xcvr156_clock.clk_reset hist_post_cdc_0.in_clk_reset reset
add_connection xcvr156_clock.clk_reset hist_post_splitter_0.reset reset
add_connection xcvr156_clock.clk_reset hit_stack_subsystem_0.xcvr_reset reset
add_connection xcvr156_clock.clk_reset hit_stack_subsystem_1.xcvr_reset reset
add_connection master_datapath.master dbg_mm2runctrl_0.csr avalon
set_connection_parameter_value master_datapath.master/dbg_mm2runctrl_0.csr baseAddress 0x2200
add_connection master_datapath.master emulator_mutrig_0.csr avalon
set_connection_parameter_value master_datapath.master/emulator_mutrig_0.csr baseAddress 0x2000
add_connection master_datapath.master emulator_mutrig_1.csr avalon
set_connection_parameter_value master_datapath.master/emulator_mutrig_1.csr baseAddress 0x2040
add_connection master_datapath.master emulator_mutrig_2.csr avalon
set_connection_parameter_value master_datapath.master/emulator_mutrig_2.csr baseAddress 0x2080
add_connection master_datapath.master emulator_mutrig_3.csr avalon
set_connection_parameter_value master_datapath.master/emulator_mutrig_3.csr baseAddress 0x20c0
add_connection master_datapath.master emulator_mutrig_4.csr avalon
set_connection_parameter_value master_datapath.master/emulator_mutrig_4.csr baseAddress 0x2100
add_connection master_datapath.master emulator_mutrig_5.csr avalon
set_connection_parameter_value master_datapath.master/emulator_mutrig_5.csr baseAddress 0x2140
add_connection master_datapath.master emulator_mutrig_6.csr avalon
set_connection_parameter_value master_datapath.master/emulator_mutrig_6.csr baseAddress 0x2180
add_connection master_datapath.master emulator_mutrig_7.csr avalon
set_connection_parameter_value master_datapath.master/emulator_mutrig_7.csr baseAddress 0x21c0
add_connection master_datapath.master histogram_ingress_bridge_0.csr avalon
set_connection_parameter_value master_datapath.master/histogram_ingress_bridge_0.csr baseAddress 0x00020c00
add_connection master_datapath.master histogram_statistics_0.csr avalon
set_connection_parameter_value master_datapath.master/histogram_statistics_0.csr baseAddress 0x00020400
add_connection master_datapath.master histogram_statistics_0.hist_bin avalon
set_connection_parameter_value master_datapath.master/histogram_statistics_0.hist_bin baseAddress 0x00020000
add_connection master_datapath.master hit_stack_subsystem_0.feb_frame_assembly_csr avalon
set_connection_parameter_value master_datapath.master/hit_stack_subsystem_0.feb_frame_assembly_csr baseAddress 0x00025000
add_connection master_datapath.master hit_stack_subsystem_0.ring_buffer_cam_0_csr avalon
set_connection_parameter_value master_datapath.master/hit_stack_subsystem_0.ring_buffer_cam_0_csr baseAddress 0x00021000
add_connection master_datapath.master hit_stack_subsystem_0.ring_buffer_cam_1_csr avalon
set_connection_parameter_value master_datapath.master/hit_stack_subsystem_0.ring_buffer_cam_1_csr baseAddress 0x00021080
add_connection master_datapath.master hit_stack_subsystem_0.ring_buffer_cam_2_csr avalon
set_connection_parameter_value master_datapath.master/hit_stack_subsystem_0.ring_buffer_cam_2_csr baseAddress 0x00021100
add_connection master_datapath.master hit_stack_subsystem_0.ring_buffer_cam_3_csr avalon
set_connection_parameter_value master_datapath.master/hit_stack_subsystem_0.ring_buffer_cam_3_csr baseAddress 0x00021180
add_connection master_datapath.master hit_stack_subsystem_1.feb_frame_assembly_csr avalon
set_connection_parameter_value master_datapath.master/hit_stack_subsystem_1.feb_frame_assembly_csr baseAddress 0x00025040
add_connection master_datapath.master hit_stack_subsystem_1.ring_buffer_cam_0_csr avalon
set_connection_parameter_value master_datapath.master/hit_stack_subsystem_1.ring_buffer_cam_0_csr baseAddress 0x00023000
add_connection master_datapath.master hit_stack_subsystem_1.ring_buffer_cam_1_csr avalon
set_connection_parameter_value master_datapath.master/hit_stack_subsystem_1.ring_buffer_cam_1_csr baseAddress 0x00023080
add_connection master_datapath.master hit_stack_subsystem_1.ring_buffer_cam_2_csr avalon
set_connection_parameter_value master_datapath.master/hit_stack_subsystem_1.ring_buffer_cam_2_csr baseAddress 0x00023100
add_connection master_datapath.master hit_stack_subsystem_1.ring_buffer_cam_3_csr avalon
set_connection_parameter_value master_datapath.master/hit_stack_subsystem_1.ring_buffer_cam_3_csr baseAddress 0x00023180
add_connection master_datapath.master lvds_rx_controller_pro_0.csr avalon
set_connection_parameter_value master_datapath.master/lvds_rx_controller_pro_0.csr baseAddress 0x0000
add_connection master_datapath.master mm_pipeline_jtagmaster2rstctrl.s0 avalon
set_connection_parameter_value master_datapath.master/mm_pipeline_jtagmaster2rstctrl.s0 baseAddress 0x00011000
add_connection master_datapath.master mts_preprocessor_0.csr avalon
set_connection_parameter_value master_datapath.master/mts_preprocessor_0.csr baseAddress 0x4000
add_connection master_datapath.master mts_preprocessor_1.csr avalon
set_connection_parameter_value master_datapath.master/mts_preprocessor_1.csr baseAddress 0x8000
add_connection master_datapath.master mutrig_datapath_subsystem_0.backpressure_fifo_csr avalon
set_connection_parameter_value master_datapath.master/mutrig_datapath_subsystem_0.backpressure_fifo_csr baseAddress 0x0860
add_connection master_datapath.master mutrig_datapath_subsystem_0.csr avalon
set_connection_parameter_value master_datapath.master/mutrig_datapath_subsystem_0.csr baseAddress 0x00010900
add_connection master_datapath.master mutrig_datapath_subsystem_1.backpressure_fifo_csr avalon
set_connection_parameter_value master_datapath.master/mutrig_datapath_subsystem_1.backpressure_fifo_csr baseAddress 0x1860
add_connection master_datapath.master mutrig_datapath_subsystem_1.csr avalon
set_connection_parameter_value master_datapath.master/mutrig_datapath_subsystem_1.csr baseAddress 0x00011900
add_connection master_datapath.master mutrig_datapath_subsystem_2.backpressure_fifo_csr avalon
set_connection_parameter_value master_datapath.master/mutrig_datapath_subsystem_2.backpressure_fifo_csr baseAddress 0x2860
add_connection master_datapath.master mutrig_datapath_subsystem_2.csr avalon
set_connection_parameter_value master_datapath.master/mutrig_datapath_subsystem_2.csr baseAddress 0x00012900
add_connection master_datapath.master mutrig_datapath_subsystem_3.backpressure_fifo_csr avalon
set_connection_parameter_value master_datapath.master/mutrig_datapath_subsystem_3.backpressure_fifo_csr baseAddress 0x3860
add_connection master_datapath.master mutrig_datapath_subsystem_3.csr avalon
set_connection_parameter_value master_datapath.master/mutrig_datapath_subsystem_3.csr baseAddress 0x00013900
add_connection master_datapath.master mutrig_datapath_subsystem_4.backpressure_fifo_csr avalon
set_connection_parameter_value master_datapath.master/mutrig_datapath_subsystem_4.backpressure_fifo_csr baseAddress 0x4860
add_connection master_datapath.master mutrig_datapath_subsystem_4.csr avalon
set_connection_parameter_value master_datapath.master/mutrig_datapath_subsystem_4.csr baseAddress 0x00014900
add_connection master_datapath.master mutrig_datapath_subsystem_5.backpressure_fifo_csr avalon
set_connection_parameter_value master_datapath.master/mutrig_datapath_subsystem_5.backpressure_fifo_csr baseAddress 0x5860
